# EAGLE board DM01x2 (EAGLE 6.6.0), part 1 of 3
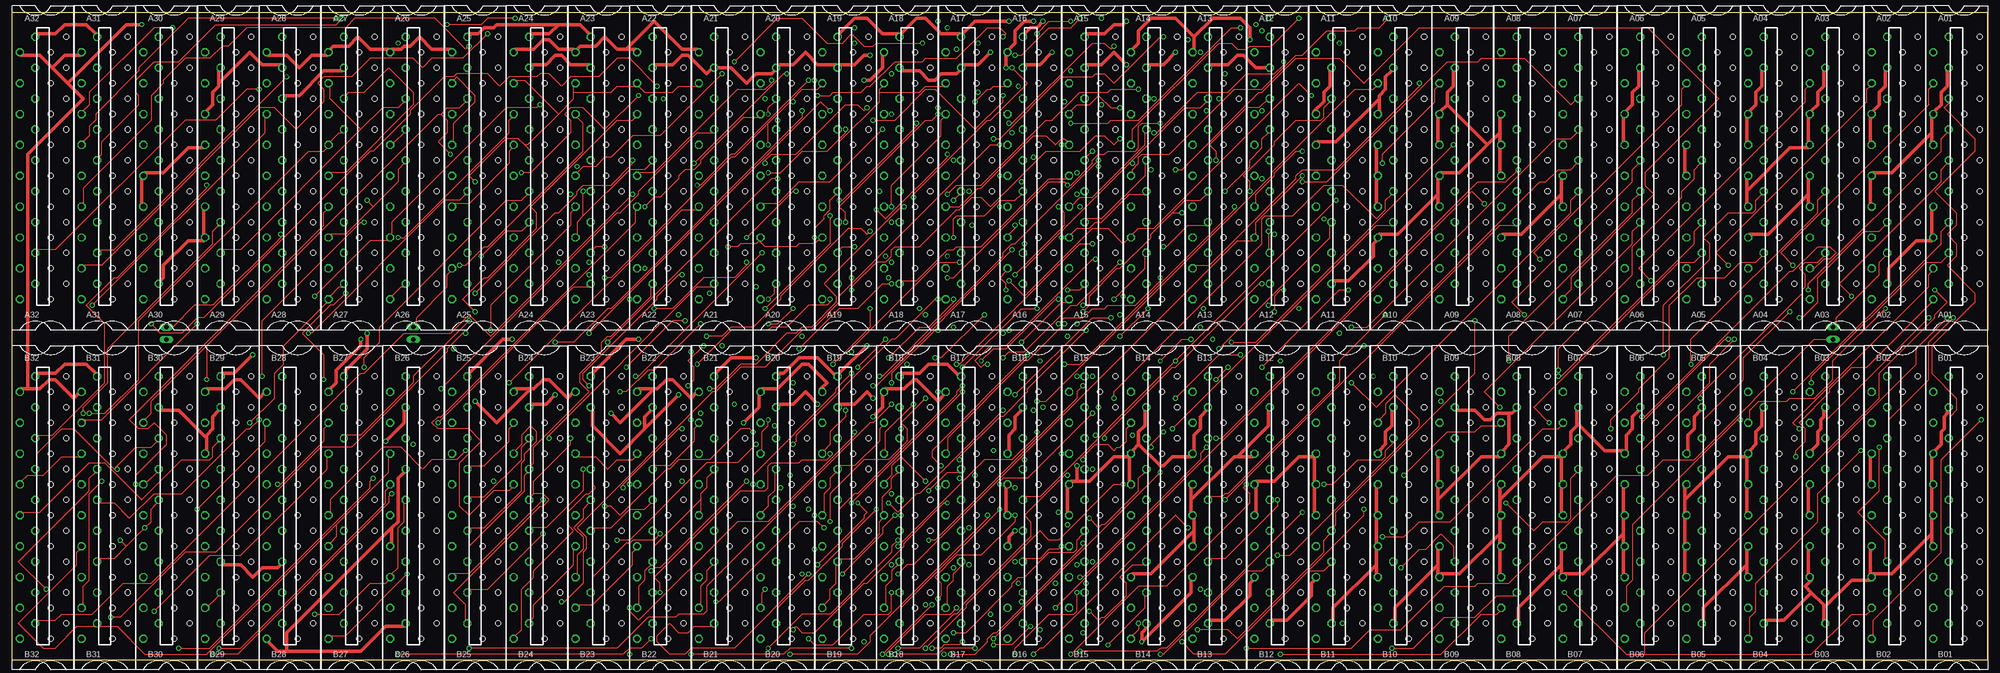
[diagram p6: board, top side]
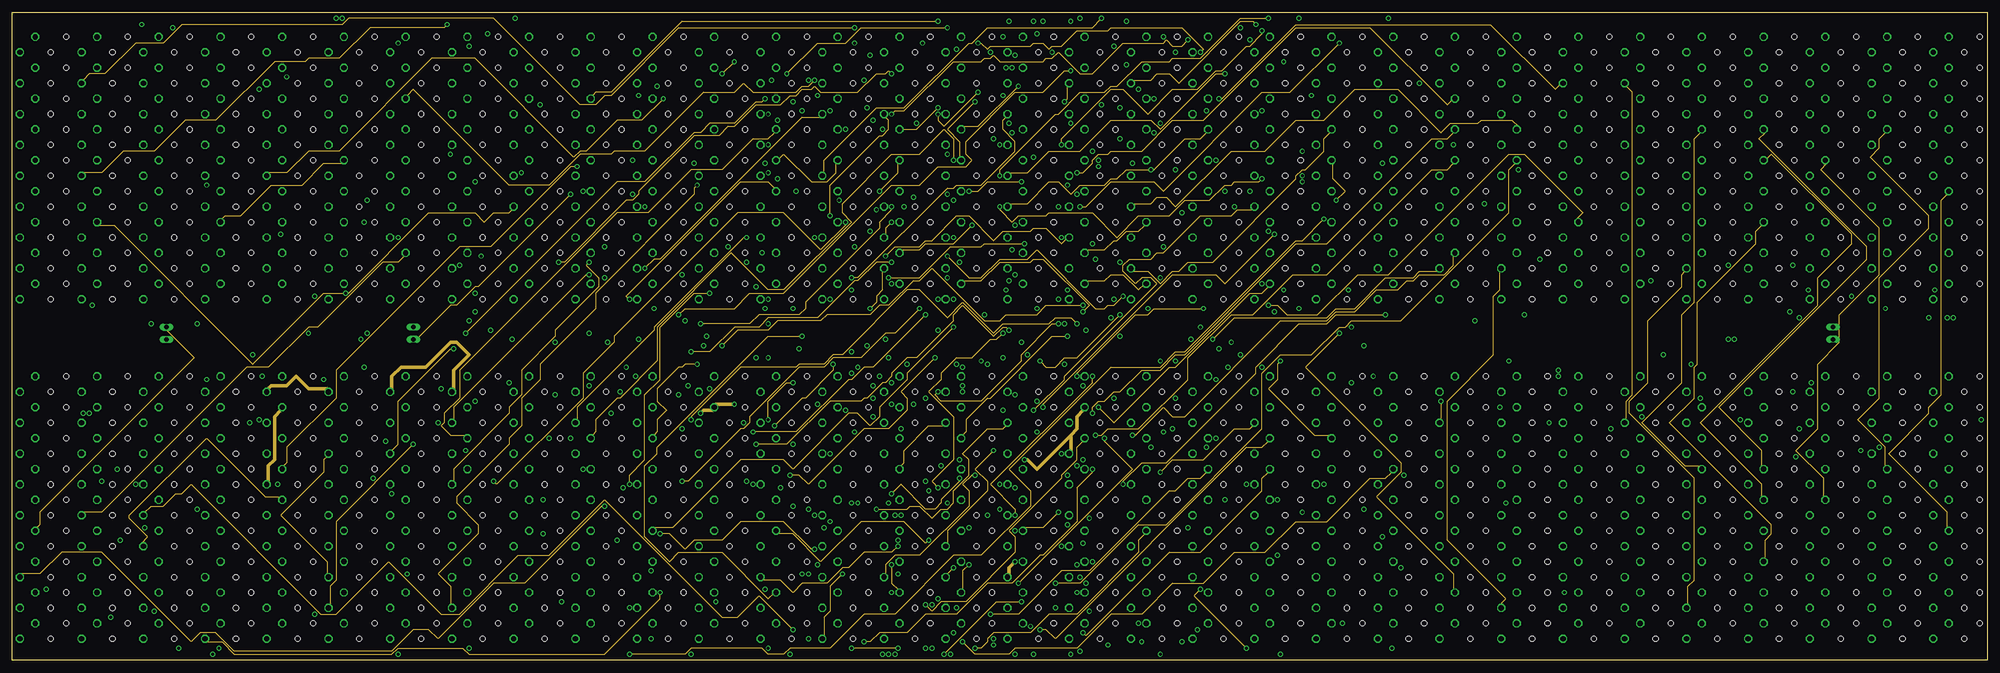
[diagram p7: board, inner layer Route2]
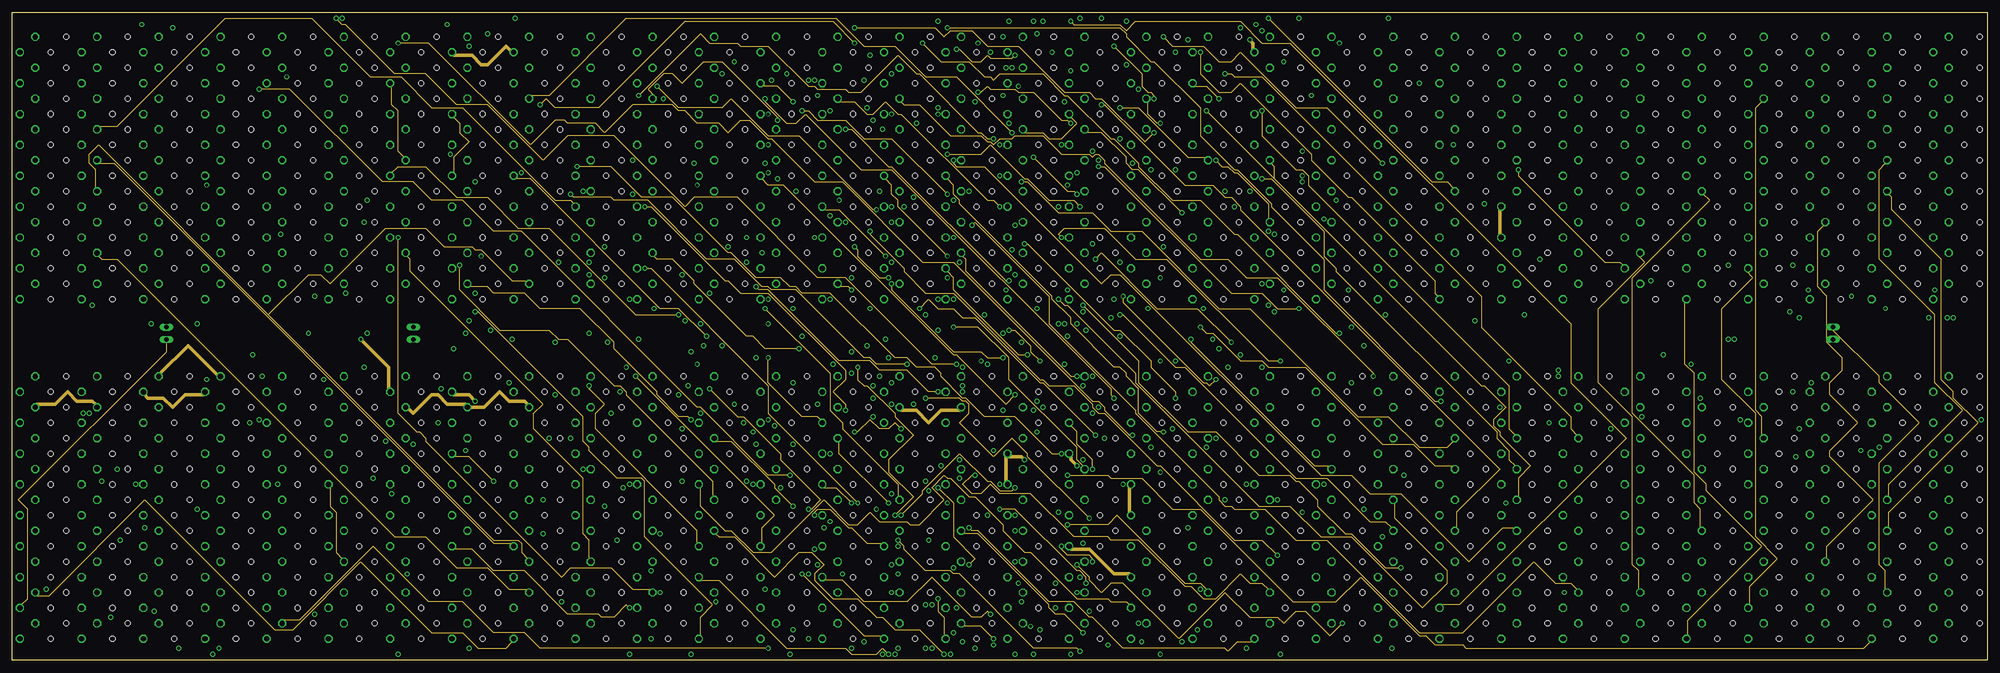
[diagram p8: board, inner layer Route15]
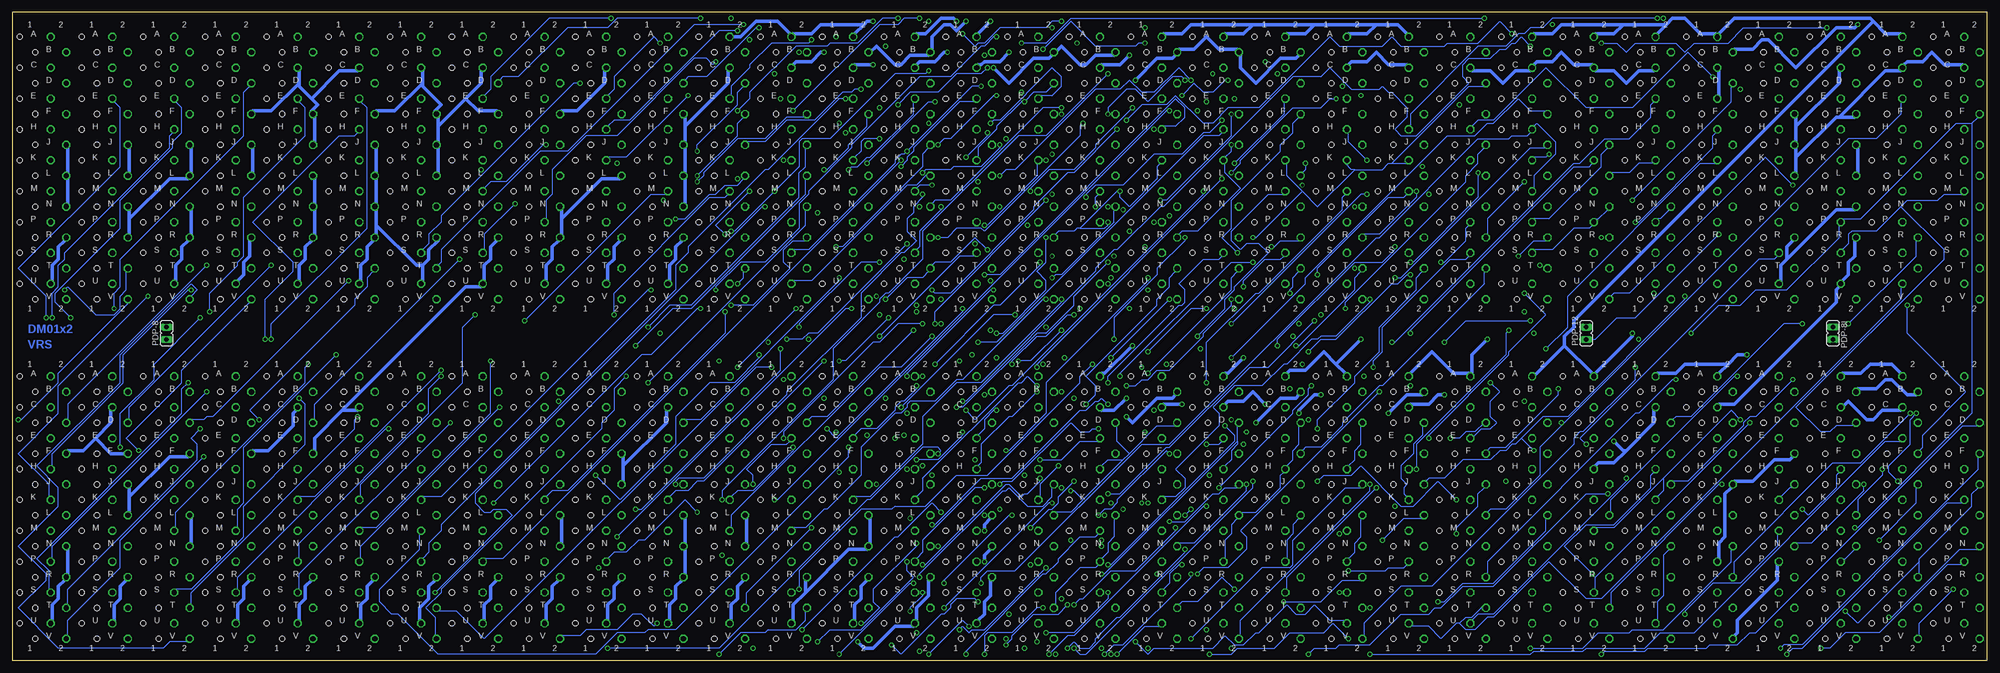
[diagram p9: board, bottom side, seen from below]

Size 406.4 x 133.35 mm. Coordinates in mm from the lower left corner, seen from the top.
Outline: 0,0 0,133.35 406.4,133.35 406.4,0 0,0
Copper layers (1*2*15*16): Top 0.035mm / dielectric 1.5mm / Route2 0.035mm / dielectric 0.15mm / Route15 0.035mm / dielectric 0.2mm / Bottom 0.035mm
Design rules "sierraproto": minimum track width 6mil, minimum drill 24mil, track to track 6mil, track to pad 6mil, pad to pad 10mil, via to via 6mil, smd to smd 6mil, copper to edge 25mil, drill to drill 10mil, minimum pad ring 10mil, minimum via ring 8mil, stop-mask expansion 0mil, vias tented up to drill 0mil, thermal gap 10mil
Net classes: 0 default: width 0.254 mm; 1 Supply: width 0.762 mm

## Footprints (pad centres in the part's own frame; a part is rotated, then mirrored left to right if it is on the bottom)
H807S = drill 1.092 octagon: A2 -1.587,28.575; B2 -4.763,25.4; C2 -1.587,22.225; D2 -4.763,19.05; E2 -1.587,15.875; F2 -4.763,12.7; H2 -1.587,9.525; J2 -4.763,6.35; K2 -1.587,3.175; L2 -4.763,0; M2 -1.587,-3.175; N2 -4.763,-6.35; P2 -1.587,-9.525; R2 -4.763,-12.7; S2 -1.587,-15.875; T2 -4.763,-19.05; U2 -1.587,-22.225; V2 -4.763,-25.4 | hole 1.092: 4.763,28.575; 1.587,25.4; 4.763,22.225; 1.587,19.05; 4.763,15.875; 1.587,12.7; 4.763,9.525; 1.587,6.35; 4.763,3.175; 1.587,0; 4.763,-3.175; 1.587,-6.35; 4.763,-9.525; 1.587,-12.7; 4.763,-15.875; 1.587,-19.05; 4.763,-22.225; 1.587,-25.4
JP1 = drill 0.914 long: 1 0,-1.27; 2 0,1.27

## Placement (x,y rotation side)
A01  W021S  [H807S]  400.05,99.69 0 top
A02  W021S  [H807S]  387.35,99.69 0 top
A03  W021S  [H807S]  374.65,99.69 0 top
A04  W021S  [H807S]  361.95,99.69 0 top
A05  W021S  [H807S]  349.25,99.69 0 top
A06  W021S  [H807S]  336.55,99.69 0 top
A07  W021S  [H807S]  323.85,99.69 0 top
A08  W021S  [H807S]  311.15,99.69 0 top
A09  W021S  [H807S]  298.45,99.69 0 top
A10  W021S  [H807S]  285.75,99.69 0 top
A11  W021S  [H807S]  273.05,99.69 0 top
A12  S107S  [H807S]  260.35,99.69 0 top
A13  S107S  [H807S]  247.65,99.69 0 top
A14  S107S  [H807S]  234.95,99.69 0 top
A15  W005S  [H807S]  222.25,99.69 0 top
A16  S111S  [H807S]  209.55,99.69 0 top
A17  S111S  [H807S]  196.85,99.69 0 top
A18  S111S  [H807S]  184.15,99.69 0 top
A19  S111S  [H807S]  171.45,99.69 0 top
A20  S111S  [H807S]  158.75,99.69 0 top
A21  S111S  [H807S]  146.05,99.69 0 top
A22  S111S  [H807S]  133.35,99.69 0 top
A23  S111S  [H807S]  120.65,99.69 0 top
A24  S111S  [H807S]  107.95,99.69 0 top
A25  S107S  [H807S]  95.25,99.69 0 top
A26  S111S  [H807S]  82.55,99.69 0 top
A27  S111S  [H807S]  69.85,99.69 0 top
A28  R202S  [H807S]  57.15,99.69 0 top
A29  W021S  [H807S]  44.45,99.69 0 top
A30  W021S  [H807S]  31.75,99.69 0 top
A31  S107S  [H807S]  19.05,99.69 0 top
A32  S181S  [H807S]  6.35,99.69 0 top
B01  W021S  [H807S]  400.05,29.84 0 top
B02  W021S  [H807S]  387.35,29.84 0 top
B03  W021S  [H807S]  374.65,29.84 0 top
B04  W021S  [H807S]  361.95,29.84 0 top
B05  W021S  [H807S]  349.25,29.84 0 top
B06  W021S  [H807S]  336.55,29.84 0 top
B07  W021S  [H807S]  323.85,29.84 0 top
B08  W021S  [H807S]  311.15,29.84 0 top
B09  W021S  [H807S]  298.45,29.84 0 top
B10  W021S  [H807S]  285.75,29.84 0 top
B11  W021S  [H807S]  273.05,29.84 0 top
B12  W021S  [H807S]  260.35,29.84 0 top
B13  W021S  [H807S]  247.65,29.84 0 top
B14  W021S  [H807S]  234.95,29.84 0 top
B15  W021S  [H807S]  222.25,29.84 0 top
B16  W021S  [H807S]  209.55,29.84 0 top
B17  R002S  [H807S]  196.85,29.84 0 top
B18  R002S  [H807S]  184.15,29.84 0 top
B19  R002S  [H807S]  171.45,29.84 0 top
B20  R002S  [H807S]  158.75,29.84 0 top
B21  R002S  [H807S]  146.05,29.84 0 top
B22  R002S  [H807S]  133.35,29.84 0 top
B23  S111S  [H807S]  120.65,29.84 0 top
B24  W005S  [H807S]  107.95,29.84 0 top
B25  S107S  [H807S]  95.25,29.84 0 top
B26  R603S  [H807S]  82.55,29.84 0 top
B27  S202S  [H807S]  69.85,29.84 0 top
B28  W640S  [H807S]  57.15,29.84 0 top
B29  R302S  [H807S]  44.45,29.84 0 top
B30  S111S  [H807S]  31.75,29.84 0 top
B31  S202S  [H807S]  19.05,29.84 0 top
B32  S107S  [H807S]  6.35,29.84 0 top
PDP-8  [JP1]  374.65,67.31 0 bottom
PDP-8I  [JP1]  31.75,67.31 180 bottom
PDP-12  [JP1]  82.55,67.31 0 bottom
U$9  [CBLOCK]  0,0 0 top
U$10  [CBLOCK]  50.8,0 0 top
U$11  [CBLOCK]  101.6,0 0 top
U$12  [CBLOCK]  152.4,0 0 top
U$13  [CBLOCK]  203.2,0 0 top
U$14  [CBLOCK]  254,0 0 top
U$15  [CBLOCK]  304.8,0 0 top
U$16  [CBLOCK]  355.6,0 0 top

## Tracks (layer width: path | path; a pad name or v marks a point on that pad's centre or on a via)
1-CA_INH  (via drill 0.61)
  Top 0.254: v20.32,8.89 22.23,8.89 35.56,22.23 41.91,22.23 63.5,43.81 69.85,43.81 89.53,63.5 89.53,64.14 92.71,67.31 v93.34,67.31 | v226.69,53.98 226.69,55.24 257.18,85.72 257.18,90.81 257.81,91.44 263.52,91.44 269.88,97.79 273.69,97.79 280.67,90.81 282.57,92.71 282.57,94.61 283.85,95.89 A10.M2
  Route2 0.254: v93.34,67.31 124.46,98.42 130.18,98.42 140.34,108.58 141.6,108.58 143.51,110.49 148.59,110.49 153.03,114.94 154.31,114.94 v154.94,115.57
  Route15 0.254: v154.94,115.57 154.94,114.94 159.38,110.49 161.29,110.49 163.19,112.39 174.62,100.97 180.97,100.97 226.06,55.88 226.06,54.61 v226.69,53.98
  Bottom 0.254: v20.32,8.89 19.68,8.89 5.71,22.86 1.91,22.86 B32.N2
1-CA_INH0  (via drill 0.61)
  Top 0.254: v124.46,24.77 127,24.77 142.88,40.64 149.22,40.64 v153.03,44.45
  Route2 0.254: v153.03,44.45 159.38,44.45 168.28,53.34 174.62,53.34 175.26,53.98 175.9,53.98 179.07,57.15 179.71,57.15 180.97,58.42 180.97,59.05 184.15,62.23 186.06,62.23 193.68,69.85 193.68,71.12 195.58,73.03 201.93,66.67 203.84,68.58 204.47,68.58 v205.1,67.94 | v211.46,61.59 212.72,60.33 214.63,60.33 216.53,62.23 219.07,62.23 v227.97,71.12
  Route15 0.254: v205.1,67.94 206.38,67.94 209.55,64.77 209.55,63.5 v211.46,61.59 | v227.97,71.12 228.6,71.12 239.4,60.33 241.3,60.33 264.16,37.47 270.51,37.47 279.4,28.57 282.57,28.57 283.85,27.3 B10.M2
  Bottom 0.254: v124.46,24.77 120.02,29.21 116.2,29.21 B23.L2
1-CA_INH1  (via drill 0.61)
  Top 0.254: v163.83,4.45 165.1,3.17 168.91,3.17 175.26,9.53 180.34,9.53 180.97,10.16 v180.97,13.97 | v193.68,5.71 196.22,5.71 205.74,15.24 205.74,15.88 207.01,17.14 208.28,17.14 213.36,22.23 218.44,22.23 219.07,22.86 219.07,24.77 220.34,26.04 B15.M2
  Bottom 0.254: v163.83,4.45 149.22,19.05 143.51,19.05 142.88,19.68 142.88,24.77 132.08,35.56 128.91,35.56 B22.J2 | v180.97,13.97 180.97,12.7 187.96,5.71 v193.68,5.71
!-BMB3
  Route2 0.254: B03.K2 372.75,33.66 372.75,37.47 367.03,43.18 371.48,47.62 371.48,60.96 375.92,65.41 375.92,71.12 384.18,79.38 384.18,88.9 372.11,100.97 373.38,102.23 A03.K2
!-BMB4
  Route15 0.254: B03.P2 373.38,20.95 373.38,23.5 382.9,33.02 374.01,41.91 374.01,43.18 379.73,48.9 374.01,54.61 374.01,57.15 376.56,59.69 376.56,62.23 373.38,65.41 373.38,74.93 371.48,76.83 371.48,88.27 372.75,89.53 A03.P2
!-BMB5  (via drill 0.61)
  Top 0.254: v335.28,50.16 335.92,50.16 365.76,80.01 366.39,80.01 371.48,85.09 374.01,85.09 375.29,83.82 374.01,82.55 372.75,82.55 370.2,80.01 A03.T2
  Bottom 0.254: v335.28,50.16 335.92,49.53 335.92,47.62 369.57,13.97 369.57,11.43 B03.T2
!-BMB6  (via drill 0.61)
  Top 0.254: v385.44,72.39 374.65,61.59 374.65,57.78 370.84,53.98 365.76,53.98 365.12,53.34 359.41,53.34 357.5,51.44 357.5,49.53 B04.D2
  Bottom 0.254: v385.44,72.39 385.44,75.56 384.18,76.83 384.18,82.55 358.77,107.95 358.77,116.84 357.5,118.11 A04.D2
!-BMB7
  Route2 0.254: B04.H2 360.05,40.01 360.05,43.18 351.15,52.07 381.63,82.55 381.63,85.09 359.41,107.31 360.68,108.58 A04.H2
!-BMB8  (via drill 0.61)
  Top 0.254: v339.73,62.87 339.73,73.03 349.25,82.55 349.25,85.72 347.98,87 353.06,92.08 358.14,92.08 358.77,92.71 358.77,94.61 360.05,95.89 A04.M2
  Bottom 0.254: v339.73,62.87 358.77,43.81 358.77,32.38 360.05,31.11 360.05,27.3 B04.M2
!BREAK  (via drill 0.61)
  Top 0.254: v48.9,48.9 53.98,53.98 53.98,59.05 55.88,60.96 55.88,64.77 64.77,73.66 A27.V2 65.41,74.93 67.31,76.83 67.94,76.83 A27.U2
  Bottom 0.254: v48.9,48.9 80.64,17.14 80.64,14.61 B26.S2
!BRK_SYNC_CLK
  Top 0.254: PDP-12.2 83.19,69.22 83.19,70.48 89.53,76.83 89.53,79.38 90.17,80.01 A25.T2
-15V  (via drill 0.61)
  Top 0.762: 243.21,128.27 243.21,125.73 A13.B2 | 243.21,128.27 239.4,132.08 234.31,132.08 231.78,129.54 231.78,127 230.5,125.73 A14.B2 | v254.63,127.64 254.63,130.18 252.73,132.08 247.01,132.08 243.21,128.27 | A28.B2 52.7,124.46 56.52,124.46 59.05,121.92 61.59,124.46 64.77,124.46 A27.B2 65.41,125.73 66.04,126.36 69.22,126.36 71.12,128.27 73.66,125.73 77.47,125.73 A26.B2 78.11,125.73 80.01,125.73 80.64,126.36 81.92,126.36 83.82,128.27 86.36,125.73 90.17,125.73 A25.B2 | v204.47,121.92 204.47,124.46 A16.B2 205.1,125.73 206.38,127 206.38,129.54 208.28,131.44 v210.19,131.44 | A24.B2 103.5,125.73 107.31,125.73 109.22,127.64 110.49,127.64 112.39,125.73 115.57,125.73 A23.B2 116.2,125.73 116.84,126.36 120.02,126.36 121.92,128.27 124.46,125.73 126.36,125.73 | 126.36,125.73 128.27,125.73 A22.B2 | 126.36,125.73 132.08,131.44 137.79,125.73 140.97,125.73 A21.B2 | v175.26,119.38 176.53,119.38 179.07,121.92 179.07,124.46 A18.B2 | B17.B2 191.77,54.61 190.5,53.34 186.06,57.78 185.42,57.78 183.51,55.88 179.71,55.88 B18.B2 179.07,54.61 179.07,52.07 v177.16,50.16 | B19.B2 166.37,55.88 167.64,57.15 163.83,60.96 162.56,60.96 157.48,55.88 154.31,55.88 B20.B2 153.67,54.61 153.67,52.07 v150.5,48.9 | 106.68,55.88 107.31,55.88 109.22,57.78 110.49,57.78 114.3,53.98 115.57,55.24 B23.B2 | 106.68,55.88 103.5,55.88 B24.B2 | 132.08,55.88 132.72,55.88 134.62,57.78 135.89,57.78 139.7,53.98 140.97,55.24 B21.B2 | 132.08,55.88 128.91,55.88 B22.B2 | v123.19,50.8 125.09,48.9 132.08,55.88 | v95.25,53.34 99.69,48.9 106.68,55.88 | B29.B2 40.01,55.88 43.81,55.88 45.72,57.78 46.99,57.78 50.8,53.98 52.07,55.24 B28.B2
  Top 0.762: 8.26,121.92 5.71,124.46 1.91,124.46 A32.B2 | 8.26,121.92 10.79,124.46 13.97,124.46 A31.B2 | 3.17,55.88 5.71,55.88 7.62,57.78 8.89,57.78 12.7,53.98 13.97,55.24 B31.B2 | 3.17,55.88 1.91,55.88 B32.B2 | 11.43,118.75 14.61,115.57 3.17,104.14 3.17,55.88 | 11.43,118.75 8.26,121.92 | v71.75,66.04 71.75,64.77 66.67,59.69 66.67,57.15 65.41,55.88 B27.B2 | v26.67,130.81 23.5,130.81 11.43,118.75
  Route2 0.762: B26.B2 78.11,55.88 78.11,58.42 80.01,60.33 85.09,60.33 90.17,65.41 91.44,65.41 93.98,62.87 90.81,59.69 90.81,55.88 B25.B2 | B27.B2 64.77,55.88 60.96,55.88 58.42,58.42 56.52,56.52 53.34,56.52 52.7,55.88 B28.B2
  Route15 0.762: v254.63,127.64 255.27,127 255.27,125.73 A12.B2 | A25.B2 90.81,124.46 94.61,124.46 96.52,122.56 97.79,122.56 101.6,126.36 102.87,125.09 A24.B2 | v95.25,53.34 93.98,54.61 90.81,54.61 B25.B2 | B29.B2 39.37,54.61 35.56,54.61 33.02,52.07 31.11,53.98 27.94,53.98 27.3,54.61 B30.B2 | v71.75,66.04 77.47,60.33 77.47,55.88 B26.B2
  Bottom 0.762: A14.B2 229.87,125.09 228.6,126.36 224.79,122.56 223.52,122.56 221.62,124.46 217.81,124.46 A15.B2 217.17,125.73 217.17,128.27 214.63,130.81 213.36,130.81 212.09,129.54 v210.19,131.44 | A18.B2 179.71,124.46 183.51,124.46 185.42,122.56 186.69,122.56 190.5,126.36 191.77,125.09 A17.B2 192.41,124.46 193.04,123.83 196.22,123.83 201.29,118.75 v204.47,121.92 | A21.B2 141.6,124.46 142.24,123.83 145.41,123.83 150.5,118.75 153.67,121.92 153.67,124.46 A20.B2 154.31,125.73 158.12,125.73 160.66,128.27 163.19,125.73 166.37,125.73 A19.B2 167,124.46 167.64,123.83 170.81,123.83 v175.26,119.38 | v177.16,50.16 175.9,48.9 170.81,53.98 167.64,53.98 167,54.61 B19.B2 | v123.19,50.8 119.38,54.61 116.2,54.61 B23.B2 | v150.5,48.9 145.41,53.98 142.24,53.98 141.6,54.61 B21.B2 | B30.B2 26.67,55.88 22.86,55.88 20.95,57.78 19.68,57.78 16.51,54.61 14.61,54.61 B31.B2 | v26.67,130.81 27.3,130.18 31.11,130.18 39.37,121.92 45.09,127.64 46.35,127.64 48.26,125.73 52.07,125.73 A28.B2
-AC_CLEAR  (via drill 0.61)
  Top 0.254: v306.07,52.07 302.89,55.24 333.38,85.72 333.38,88.27 334.64,89.53 A06.P2
  Bottom 0.254: v306.07,52.07 334.64,23.5 334.64,20.95 B06.P2
-BAC0  (via drill 0.61)
  Top 0.254: v366.39,81.28 363.86,83.82 394.33,114.3 394.33,117.47 394.97,118.11 A01.D2
  Bottom 0.254: v366.39,81.28 394.97,52.7 394.97,49.53 B01.D2
-BAC1
  Top 0.254: B01.E2 398.78,46.35 398.78,50.16 400.05,51.44 400.05,53.98 394.97,59.05 394.97,64.77 403.86,73.66 403.86,75.56 398.14,81.28 400.05,83.19 400.05,85.72 398.14,87.63 400.05,89.53 400.05,92.08 395.61,96.52 403.86,104.78 403.86,107.31 397.51,113.67 398.78,114.94 A01.E2
-BAC2  (via drill 0.61)
  Top 0.254: v369.57,76.2 369.57,77.47 396.88,104.78 396.88,107.31 398.14,108.58 A01.H2
  Bottom 0.254: v369.57,76.2 370.2,76.2 383.54,62.87 383.54,57.15 398.14,42.55 398.14,40.01 B01.H2
-BAC3  (via drill 0.61)
  Top 0.254: v378.46,74.93 375.92,77.47 396.88,98.42 396.88,100.97 398.14,102.23 A01.K2
  Bottom 0.254: v378.46,74.93 396.88,56.52 396.88,50.8 405.13,42.55 398.78,36.2 398.78,33.66 B01.K2
-BAC4
  Route2 0.254: B01.M2 398.14,27.3 398.14,30.48 386.08,42.55 394.33,50.8 394.33,52.07 396.88,54.61 396.88,94.61 398.14,95.89 A01.M2
-BAC5  (via drill 0.61)
  Top 0.254: v366.39,55.24 396.88,85.72 396.88,88.27 398.14,89.53 A01.P2
  Bottom 0.254: v366.39,55.24 398.14,23.5 398.14,20.95 B01.P2
-BAC6  (via drill 0.61)
  Top 0.254: v370.2,57.15 370.2,58.42 393.7,81.92 396.88,81.92 398.14,83.19 A01.S2
  Bottom 0.254: v370.2,57.15 371.48,55.88 371.48,50.8 401.32,20.95 398.78,18.41 398.78,14.61 B01.S2
-BAC7  (via drill 0.61)
  Top 0.254: v367.67,47.62 366.39,48.9 394.33,76.83 394.33,79.38 394.97,80.01 A01.T2
  Bottom 0.254: v367.67,47.62 369.57,45.72 368.3,44.45 368.3,41.27 394.97,14.61 394.97,11.43 B01.T2
-BAC8  (via drill 0.61)
  Top 0.254: v367.03,41.91 367.03,43.18 368.94,45.09 368.94,47.62 367.67,48.9 374.01,55.24 374.01,55.88 378.46,60.33 381.63,60.33 394.97,73.66 A01.V2
  Bottom 0.254: v367.03,41.91 384.18,24.77 384.18,19.05 394.97,8.26 394.97,5.08 B01.V2
-BAC9  (via drill 0.61)
  Top 0.254: v353.06,81.28 350.52,83.82 381.63,114.94 381.63,117.47 382.27,118.11 A02.D2
  Bottom 0.254: v353.06,81.28 382.27,52.07 382.27,49.53 B02.D2
-BAC10  (via drill 0.61)
  Top 0.254: v399.42,70.48 394.33,65.41 394.33,57.78 386.08,49.53 386.08,46.35 B02.E2
  Bottom 0.254: v399.42,70.48 399.42,74.93 405.13,80.64 384.18,101.6 384.18,113.67 385.44,114.94 A02.E2
-BAC11
  Route2 0.254: B02.H2 385.44,40.01 385.44,43.81 379.73,49.53 384.18,53.98 384.18,78.74 394.33,88.9 394.33,91.44 382.27,103.5 384.18,105.41 384.18,107.31 385.44,108.58 A02.H2
-BMB0  (via drill 0.61)
  Top 0.254: v337.19,78.11 334.64,80.64 368.94,114.94 368.94,117.47 369.57,118.11 A03.D2
  Bottom 0.254: v337.19,78.11 365.12,50.16 366.39,50.16 367.03,49.53 369.57,49.53 B03.D2
-BMB1  (via drill 0.61)
  Top 0.254: v394.33,70.48 373.38,49.53 373.38,46.35 B03.E2
  Bottom 0.254: v394.33,70.48 397.51,73.66 397.51,75.56 384.18,88.9 384.18,94.61 373.38,105.41 373.38,106.68 371.48,108.58 371.48,113.67 372.75,114.94 A03.E2
-BMB2  (via drill 0.61)
  Top 0.254: v398.14,70.48 391.8,64.14 391.8,60.96 373.38,42.55 373.38,40.01 B03.H2
  Bottom 0.254: v398.14,70.48 398.14,75.56 396.88,76.83 396.88,81.28 395.61,82.55 395.61,83.82 374.01,105.41 374.01,107.95 373.38,108.58 A03.H2
-BMB3  (via drill 0.61)
  Top 0.254: v345.44,60.96 345.44,66.04 371.48,92.08 371.48,94.61 372.75,95.89 A03.M2
  Bottom 0.254: v345.44,60.96 346.07,60.33 346.07,57.15 372.75,30.48 372.75,27.3 B03.M2
-BMB4  (via drill 0.61)
  Top 0.254: v347.35,53.98 347.35,54.61 368.3,75.56 368.3,76.2 368.94,76.83 368.94,79.38 367.67,80.64 368.94,81.92 371.48,81.92 372.75,83.19 A03.S2
  Bottom 0.254: v347.35,53.98 346.07,52.7 346.07,44.45 358.77,31.75 358.77,25.4 369.57,14.61 372.75,14.61 B03.S2
-BMB5
  Bottom 0.254: B03.V2 370.2,3.81 374.01,3.81 375.29,2.54 396.88,2.54 405.13,10.79 399.42,16.51 399.42,17.78 405.13,23.5 396.88,31.75 396.88,35.56 401.32,40.01 384.18,57.15 384.18,62.87 369.57,77.47 368.3,76.2 369.57,74.93 A03.V2
-BMB6
  Route15 0.254: B04.E2 360.05,46.35 360.05,50.16 358.77,51.44 358.77,113.67 360.05,114.94 A04.E2
-BMB7
  Route2 0.254: B04.K2 360.05,33.66 360.05,36.2 347.35,48.9 371.48,73.03 371.48,78.74 378.46,85.72 378.46,87.63 361.95,104.14 360.68,102.87 A04.K2
-BMB8
  Route2 0.254: B04.P2 360.68,20.95 360.68,24.77 361.95,26.04 361.95,27.94 341,48.9 346.07,53.98 346.07,60.33 346.71,60.96 346.71,73.66 358.77,85.72 358.77,88.27 360.05,89.53 A04.P2
-BMB9  (via drill 0.61)
  Top 0.254: v328.93,47.62 328.93,49.53 334.64,55.24 334.64,55.88 341,62.23 341,73.03 346.71,78.74 352.43,78.74 355.6,81.92 358.77,81.92 360.05,83.19 A04.S2
  Bottom 0.254: v328.93,47.62 329.56,47.62 360.05,17.14 360.05,14.61 B04.S2
-BMB10
  Route15 0.254: B04.T2 357.5,11.43 357.5,15.24 363.22,20.95 358.77,25.4 358.77,50.8 351.79,57.78 351.79,72.39 358.14,78.74 356.87,80.01 A04.T2
-BMB11  (via drill 0.61)
  Top 0.254: v380.37,43.18 371.48,34.29 371.48,28.57 358.77,15.88 358.77,10.16 357.5,8.89 357.5,5.08 B04.V2
  Bottom 0.254: v380.37,43.18 382.9,45.72 371.48,57.15 371.48,59.69 357.5,73.66 A04.V2
-BRK_IN_PRG  (via drill 0.61)
  Top 0.254: v51.44,58.42 51.44,69.85 71.75,90.17 v72.39,90.17
  Bottom 0.254: v51.44,58.42 52.07,58.42 77.47,33.02 77.47,30.48 B26.L2 | v72.39,90.17 71.75,90.17 56.52,105.41 56.52,107.95 55.88,108.58 A28.H2
-IM0  (via drill 0.61)
  Top 0.254: v314.32,82.55 313.06,83.82 343.54,114.3 343.54,117.47 344.17,118.11 A05.D2
  Bottom 0.254: v314.32,82.55 344.17,52.7 344.17,49.53 B05.D2
-IM1  (via drill 0.61)
  Top 0.254: v365.76,71.75 356.24,62.23 356.24,57.78 347.98,49.53 347.98,46.35 B05.E2
  Bottom 0.254: v365.76,71.75 365.76,75.56 360.05,81.28 360.05,81.92 358.77,83.19 358.77,95.25 346.07,107.95 346.07,113.67 347.35,114.94 A05.E2
-IM2
  Route2 0.254: B05.H2 347.35,40.01 344.17,40.01 335.28,48.9 343.54,57.15 343.54,71.12 346.07,73.66 346.07,107.31 347.35,108.58 A05.H2
-IM3  (via drill 0.61)
  Top 0.254: v318.13,59.69 318.13,64.14 333.38,79.38 333.38,85.09 343.54,95.25 343.54,96.52 346.07,99.06 346.07,100.97 347.35,102.23 A05.K2
  Bottom 0.254: v318.13,59.69 344.17,33.66 347.35,33.66 B05.K2
-IM4
  Route15 0.254: B05.M2 347.35,27.3 347.35,31.11 346.07,32.38 346.07,38.1 333.38,50.8 333.38,78.74 349.25,94.61 347.98,95.89 A05.M2
-IM5  (via drill 0.61)
  Top 0.254: v318.13,58.42 318.77,58.42 346.07,85.72 346.07,88.27 347.35,89.53 A05.P2
  Bottom 0.254: v318.13,58.42 320.68,55.88 320.68,50.8 347.35,24.13 347.35,20.95 B05.P2
-IM6  (via drill 0.61)
  Top 0.254: v316.23,48.9 313.06,52.07 342.9,81.92 346.07,81.92 347.35,83.19 A05.S2
  Bottom 0.254: v316.23,48.9 347.35,17.78 347.35,14.61 B05.S2
-IM7
  Route2 0.254: B05.T2 344.81,11.43 344.81,15.24 346.07,16.51 346.07,37.47 332.74,50.8 332.74,53.34 336.55,57.15 336.55,69.85 343.54,76.83 343.54,79.38 344.17,80.01 A05.T2
-IM8
  Route15 0.254: B05.V2 344.81,5.08 344.81,8.26 360.05,23.5 348.62,34.92 348.62,36.2 346.07,38.73 346.07,59.05 344.17,60.96 344.17,73.66 A05.V2
-IM9
  Route2 0.254: B06.D2 332.11,49.53 332.11,53.34 333.38,54.61 333.38,116.84 332.11,118.11 A06.D2
-IM10  (via drill 0.61)
  Top 0.254: v353.06,66.04 352.43,66.04 335.28,48.9 335.28,46.35 B06.E2
  Bottom 0.254: v353.06,66.04 353.06,69.22 333.38,88.9 333.38,113.67 334.64,114.94 A06.E2
-IM11  (via drill 0.61)
  Top 0.254: v354.33,66.04 349.25,60.96 349.25,57.15 335.28,43.18 335.28,40.01 B06.H2
  Bottom 0.254: v354.33,66.04 354.33,74.3 348.62,80.01 348.62,81.92 356.87,90.17 339.09,107.95 335.92,107.95 335.28,108.58 A06.H2
-INTERRUPT  (via drill 0.61)
  Top 0.254: v307.98,61.59 307.98,66.67 333.38,92.08 333.38,94.61 334.64,95.89 A06.M2
  Bottom 0.254: v307.98,61.59 307.98,50.8 331.47,27.3 334.64,27.3 B06.M2
-SKIP  (via drill 0.61)
  Top 0.254: v311.15,71.12 308.61,73.66 333.38,98.42 333.38,100.97 334.64,102.23 A06.K2
  Bottom 0.254: v311.15,71.12 313.69,68.58 313.69,57.15 334.64,36.2 334.64,33.66 B06.K2
ADD_ACC  (via drill 0.61)
  Top 0.254: 21.59,40.01 v21.59,39.37 | 21.59,40.01 25.4,43.81 28.57,43.81 29.84,45.09 B30.E2 | 21.59,40.01 20.95,39.37 12.7,47.62 10.16,47.62 5.08,42.55 5.08,40.01 B32.H2 | v302.89,93.98 300.36,96.52 v214.63,10.79 | v192.41,32.38 191.77,32.38 183.51,24.13 183.51,23.5 175.9,15.88 175.26,15.88 165.1,5.71 162.56,5.71 161.29,6.99 v160.66,6.35
  Route2 0.254: v160.66,6.35 153.67,13.34 149.22,8.89 146.05,8.89 121.92,33.02 110.49,21.59 104.14,21.59 92.08,9.53 88.27,9.53 77.47,20.32 66.67,9.53 63.5,9.53 36.83,36.2 34.92,34.29 33.66,34.29 31.11,31.75 28.57,31.75 27.3,30.48 B30.L2
  Bottom 0.254: v21.59,39.37 21.59,38.1 26.67,33.02 26.67,30.48 B30.L2 | v302.89,93.98 309.25,87.63 309.25,84.45 A08.S2 | v214.63,10.79 193.04,32.38 v192.41,32.38
ADD_ACC0  (via drill 0.61)
  Top 0.254: v283.85,2.54 288.29,2.54 294.64,8.89 300.99,8.89 305.44,13.34 309.25,13.34 B08.S2
  Route2 0.254: v116.2,101.6 114.94,101.6 98.42,85.09 92.08,85.09 66.67,59.69 66.67,53.98 56.52,43.81 56.52,40.64 55.88,40.01 B28.H2
  Route15 0.254: v215.9,42.55 214,42.55 206.38,50.16 200.03,50.16 196.22,53.98 195.58,53.98 191.13,58.42 191.13,59.05 189.87,60.33 186.06,60.33 184.15,62.23 181.61,62.23 168.28,75.56 162.56,75.56 161.29,76.83 160.02,76.83 158.12,78.74 153.03,78.74 147.96,83.82 147.32,83.82 135.89,95.25 129.54,95.25 123.19,101.6 v116.2,101.6
  Bottom 0.254: v283.85,2.54 260.99,2.54 230.5,33.02 229.87,33.02 219.07,43.81 215.9,43.81 215.26,43.18 v215.9,42.55
ADD_ACC1  (via drill 0.61)
  Top 0.254: v93.98,2.54 124.46,2.54 130.81,8.89 136.53,8.89 137.16,9.53 142.24,9.53 142.88,10.16 142.88,15.24 176.53,48.9 177.16,48.9 v180.97,52.7
  Route15 0.254: v217.17,27.94 225.43,27.94 227.33,29.84 241.3,15.88 244.47,15.88 245.75,14.61 B13.S2
  Bottom 0.254: v93.98,2.54 83.19,2.54 80.01,5.71 73.66,5.71 73.03,6.35 66.67,6.35 52.7,20.32 52.7,22.86 B28.N2 | v180.97,52.7 182.25,53.98 182.88,53.34 183.51,53.34 185.42,51.44 186.69,51.44 200.66,37.47 207.01,37.47 216.53,27.94 v217.17,27.94
B32M  (via drill 0.61)
  Top 0.254: v55.24,87.63 55.24,87 41.27,73.03 37.47,73.03 33.02,68.58 PDP-8I.1 | v254,2.54 275.59,2.54 279.4,6.35 285.75,6.35 294.64,15.24 300.99,15.24 301.62,15.88 307.98,15.88 330.2,38.1 336.55,38.1 339.73,41.27 346.07,41.27 370.84,66.04 PDP-8.1
  Route2 0.254: PDP-8I.1 31.75,67.94 37.47,62.23 5.71,30.48 5.71,27.94 5.08,27.3 B32.M2 | v254,2.54 243.21,13.34 v244.47,14.61 | v114.94,95.89 95.89,76.83 95.25,76.83 91.44,73.03 90.17,73.03 83.19,66.04 PDP-12.1
  Route15 0.254: v184.15,60.96 177.8,60.96 176.53,62.23 175.26,62.23 161.29,76.2 156.21,76.2 155.57,76.83 154.31,76.83 148.59,82.55 142.88,82.55 130.81,94.61 123.83,94.61 123.19,95.25 115.57,95.25 v114.94,95.89
  Bottom 0.254: v55.24,87.63 72.39,70.48 76.2,70.48 80.64,66.04 PDP-12.1 | v244.47,14.61 244.47,18.41 231.78,31.11 225.43,31.11 224.79,31.75 218.44,31.75 212.09,38.1 205.74,38.1 186.69,57.15 186.69,58.42 v184.15,60.96
B_ENABLE0  (via drill 0.61)
  Top 0.254: v247.65,102.87 247.65,104.78 246.38,106.05 254,113.67 256.54,113.67 258.44,115.57 A12.E2 | 71.75,109.22 76.2,113.67 79.38,113.67 80.64,114.94 A26.E2 | 71.75,109.22 46.99,84.45 43.18,84.45 A29.S2 | 71.75,109.22 65.41,115.57 65.41,118.11 A27.D2
  Route2 0.254: v82.55,44.45 66.67,28.57 66.67,16.51 65.41,15.24 65.41,11.43 B27.T2 | v241.94,127.64 240.66,126.36 238.76,126.36 237.49,127.64 236.85,127 228.6,127 222.25,120.65 219.71,120.65 215.26,125.09 214,123.83 212.72,123.83 212.09,123.19 203.2,123.19 201.93,124.46 201.29,123.83 200.03,123.83 199.39,123.19 193.68,123.19 183.51,113.03 181.61,113.03 v180.97,112.39 | v165.1,119.38 163.83,118.11 162.56,118.11 161.29,116.84 152.4,116.84 150.5,118.75 148.59,116.84 142.24,116.84 130.18,104.78 123.83,104.78 123.19,104.14 116.84,104.14 110.49,97.79 102.23,97.79 82.55,117.47 81.28,116.2 A26.E2
  Route15 0.254: v247.65,102.87 248.92,101.6 250.19,101.6 251.46,100.33 252.09,100.33 258.44,93.98 258.44,90.81 A12.P2
  Bottom 0.254: v82.55,44.45 83.82,45.72 46.99,82.55 43.81,82.55 43.18,83.19 A29.S2 | v241.94,127.64 242.57,127 250.19,127 254.63,122.56 254.63,121.92 258.44,118.11 258.44,116.2 A12.E2 | v180.97,112.39 180.97,113.67 177.16,117.47 175.26,117.47 172.72,114.94 167.64,120.02 165.74,120.02 v165.1,119.38
B_ENABLE1  (via drill 0.61)
  Top 0.254: v258.44,88.27 258.44,84.45 A12.S2 | v249.56,96.52 254.63,101.6 254.63,102.87 257.18,105.41 257.18,107.31 258.44,108.58 A12.H2 | v18.41,36.83 15.88,34.29 15.88,16.51 14.61,15.24 14.61,11.43 B31.T2 | v14.61,50.8 14.61,52.07 19.68,57.15 19.68,64.14 41.27,85.72 41.27,88.27 42.55,89.53 A29.P2
  Route2 0.254: A27.K2 67.94,102.23 64.14,102.23 59.69,97.79 53.34,97.79 46.99,91.44 43.81,91.44 43.18,90.81 A29.P2 | v217.81,121.28 216.53,121.28 212.09,116.84 206.38,116.84 196.22,106.68 196.22,104.14 197.49,102.87 196.22,101.6 190.5,101.6 186.69,97.79 180.97,97.79 158.75,75.56 151.76,75.56 148.59,72.39 138.43,72.39 v137.16,71.12
  Route15 0.254: v137.16,71.12 128.27,71.12 110.49,88.9 104.14,88.9 97.79,95.25 91.44,95.25 85.09,101.6 79.38,101.6 78.11,100.33 A26.L2
  Bottom 0.254: v258.44,88.27 257.81,88.27 v249.56,96.52 244.47,101.6 244.47,106.68 243.84,107.31 238.12,107.31 224.79,120.65 218.44,120.65 v217.81,121.28 | A27.K2 68.58,102.23 71.75,102.23 73.66,100.33 77.47,100.33 A26.L2 | v18.41,36.83 20.32,38.73 20.32,40.01 15.88,44.45 15.88,49.53 v14.61,50.8
BMPX0  (via drill 0.61)
  Top 0.254: v223.52,102.87 206.38,85.72 205.74,85.72 203.84,83.82 203.84,83.19 179.07,58.42 v178.44,58.42 | v151.13,81.92 151.13,81.28 148.59,78.74 142.24,78.74 135.89,72.39 v132.08,72.39 | A25.N2 90.81,93.98 93.98,93.98 102.23,102.23 102.23,104.78 102.87,105.41 A24.J2
  Bottom 0.254: v223.52,102.87 305.44,20.95 309.25,20.95 B08.P2 | v178.44,58.42 178.44,59.05 155.57,81.92 v151.13,81.92 | v132.08,72.39 132.08,73.66 107.31,98.42 107.31,99.69 104.78,102.23 104.78,104.14 103.5,105.41 A24.J2
BMPX1  (via drill 0.61)
  Top 0.254: v96.52,83.19 101.6,88.27 104.78,88.27 106.05,89.53 A24.P2 | v260.35,33.02 260.35,31.75 249.56,20.95 246.38,20.95 B13.P2
  Route2 0.254: v180.97,120.65 180.34,121.28 179.71,120.65 177.8,120.65 173.99,116.84 166.37,116.84 165.1,118.11 164.47,117.47 162.56,117.47 161.29,116.2 160.02,116.2 158.12,114.3 153.03,114.3 148.59,109.86 147.32,109.86 145.41,107.95 140.34,107.95 128.91,96.52 128.91,95.89 127.64,94.61 126.36,94.61 113.67,81.92 v112.39,81.92
  Bottom 0.254: v96.52,83.19 93.34,86.36 90.81,86.36 A25.R2 | v260.35,33.02 260.35,34.92 237.49,57.78 237.49,64.14 227.97,73.66 227.97,74.3 226.69,75.56 226.06,75.56 219.07,82.55 219.07,88.27 199.39,107.95 193.68,107.95 v180.97,120.65 | v112.39,81.92 111.76,81.92 107.31,86.36 107.31,88.9 106.68,89.53 A24.P2
BREAK  (via drill 0.61)
  Top 0.254: 74.3,93.34 79.38,98.42 79.38,100.97 80.64,102.23 A26.K2 | 74.3,93.34 68.58,87.63 65.41,87.63 A27.R2 | v249.56,33.02 306.07,89.53 309.25,89.53 A08.P2 | v168.28,113.03 166.37,114.94 v118.75,67.31 | 74.3,93.34 v73.03,94.61
  Route15 0.254: A26.D2 78.11,118.11 78.11,114.3 79.38,113.03 79.38,104.78 80.64,103.5 A26.K2
  Bottom 0.254: v249.56,33.02 248.92,33.02 168.91,113.03 v168.28,113.03 | v118.75,67.31 118.75,67.94 85.09,101.6 81.92,101.6 81.28,102.23 A26.K2 | v73.03,94.61 52.7,114.94 52.7,118.11 A28.D2
BRK_REQ  (via drill 0.61)
  Top 0.254: v79.38,1.27 125.73,1.27 127,2.54 129.54,2.54 v131.44,4.45 | v160.02,1.27 173.99,1.27 176.53,3.81 176.53,5.08 200.66,29.21 v200.66,29.84
  Route2 0.254: v214.63,15.88 219.71,15.88 231.78,27.94 237.49,27.94 257.18,47.62 257.18,59.05 260.99,62.87 267.33,62.87 273.05,68.58 274.32,68.58 275.59,69.85 285.75,69.85 307.98,92.08 307.98,100.97 309.25,102.23 A08.K2
  Bottom 0.254: v79.38,1.27 78.74,1.91 70.48,1.91 69.85,2.54 57.78,2.54 57.15,3.17 51.44,3.17 48.9,5.71 47.62,5.71 5.08,48.26 1.91,48.26 B32.D2 | v131.44,4.45 134.62,7.62 136.53,5.71 143.51,5.71 146.69,2.54 154.31,2.54 155.57,1.27 v160.02,1.27 | v200.66,29.84 201.29,29.84 214.63,16.51 v214.63,15.88
BRK_REQ0  (via drill 0.61)
  Top 0.254: v93.34,43.18 91.44,41.27 86.36,41.27 84.45,39.37 80.01,43.81 76.2,43.81 65.41,33.02 65.41,30.48 B27.L2 | v62.23,74.93 73.66,86.36 77.47,86.36 A26.R2 78.11,87.63 78.11,90.17 101.6,113.67 107.95,113.67 v108.58,114.3 | v206.38,124.46 207.65,124.46 213.36,130.18 217.81,130.18 v219.71,132.08
  Route15 0.254: 259.71,99.06 302.26,56.52 302.89,56.52 307.34,52.07 304.8,49.53 304.8,48.26 306.07,46.99 306.07,46.35 312.42,40.01 309.88,37.47 309.88,33.66 B08.K2 | 259.71,99.06 259.71,101.6 259.08,102.23 A12.K2 | v108.58,114.3 109.86,115.57 111.76,113.67 120.65,113.67 138.43,131.44 168.91,131.44 v173.35,127 | v194.31,125.73 194.94,125.73 197.49,123.19 199.39,123.19 200.66,124.46 201.29,123.83 205.74,123.83 v206.38,124.46 | v245.75,113.03 259.71,99.06
  Bottom 0.254: 95.89,45.72 v93.34,43.18 | 95.89,45.72 97.16,44.45 97.79,44.45 99.06,43.18 100.33,43.18 102.23,41.27 107.95,41.27 111.76,37.47 114.94,37.47 115.57,36.83 B23.J2 | v62.23,74.93 62.23,74.3 86.36,50.16 91.44,50.16 95.89,45.72 | v173.35,127 174.62,127 175.26,126.36 183.51,126.36 188.59,131.44 v194.31,125.73 | v219.71,132.08 222.88,132.08 224.16,130.81 227.97,130.81 v245.75,113.03
BRK_REQ1  (via drill 0.61)
  Top 0.254: v282.57,71.12 273.05,61.59 273.05,57.15 250.19,34.29 249.56,34.29 248.92,33.66 246.38,33.66 B13.K2 | v228.6,36.2 226.69,36.2 215.26,24.77 213.36,24.77 211.46,26.67 196.22,11.43 196.22,10.79 v187.96,2.54 | v151.13,36.83 133.35,19.05 132.08,19.05 v131.44,18.41
  Route2 0.254: B31.L2 14.61,30.48 18.41,30.48 48.26,60.33 52.7,60.33 60.96,68.58 62.87,68.58 76.2,81.92 79.38,81.92 80.64,83.19 A26.S2 | v282.57,71.12 272.42,71.12 270.51,69.22 264.8,69.22 255.91,60.33 255.91,59.05 237.49,40.64 232.41,40.64 228.6,36.83 v228.6,36.2
  Route15 0.254: B23.P2 118.75,20.95 118.75,24.77 117.47,26.04 117.47,37.47 107.31,47.62 107.31,50.8 109.22,52.7 81.92,80.01 81.92,82.55 81.28,83.19 A26.S2
  Bottom 0.254: v282.57,71.12 282.57,75.56 262.89,95.25 259.71,95.25 259.08,95.89 A12.M2 | v187.96,2.54 186.69,1.27 185.42,1.27 151.13,35.56 v151.13,36.83 | v131.44,18.41 123.83,18.41 123.19,19.05 120.02,19.05 119.38,19.68 B23.P2
BRK_SYNC_CLK  (via drill 0.61)
  Top 0.254: v247.65,45.72 248.92,45.72 301.62,98.42 307.34,98.42 v309.88,100.97 | v355.6,49.53 354.96,49.53 333.38,27.94 333.38,16.51 332.11,15.24 332.11,11.43 B06.T2
  Route2 0.254: v139.7,49.53 139.7,50.16 149.86,60.33 161.29,60.33 161.93,60.96 167,60.96 168.91,62.87 170.81,62.87 184.15,76.2 186.69,76.2 192.41,70.48 195.58,73.66 201.93,67.31 203.84,69.22 213.36,69.22 214.63,70.48 217.81,70.48 v219.07,69.22
  Route15 0.254: v139.7,49.53 139.06,50.16 137.16,50.16 132.72,54.61 132.72,55.24 123.83,64.14 123.83,65.41 116.84,72.39 108.58,72.39 105.41,75.56 99.06,75.56 97.79,76.83 93.98,76.83 A25.U2 | v309.88,100.97 309.88,99.69 327.66,81.92 330.83,81.92 331.47,81.28 A06.T2
  Bottom 0.254: v219.07,69.22 224.16,69.22 227.97,65.41 229.24,65.41 247.65,46.99 v247.65,45.72 | v355.6,49.53 357.5,51.44 335.92,73.03 335.92,74.3 333.38,76.83 333.38,78.74 332.11,80.01 A06.T2
BT1B
  Top 0.254: PDP-8.2 375.29,69.22 375.29,70.48 384.18,79.38 384.18,81.92 385.44,83.19 A02.S2
  Route15 0.254: B02.S2 385.44,14.61 385.44,18.41 384.18,19.68 384.18,40.64 392.43,48.9 384.18,57.15 384.18,58.42 374.65,67.94 PDP-8.2
CYC_SEL  (via drill 0.61)
  Top 0.254: v155.57,100.33 158.12,100.33 162.56,104.78 167.64,104.78 171.45,108.58 v171.45,109.22 | v205.1,78.11 208.28,74.93 222.25,88.9 225.43,88.9 228.6,85.72 229.87,87 A14.R2 230.5,87.63 231.78,88.9 234.95,88.9 264.8,118.75 v267.33,116.2
  Route2 0.254: v133.99,115.57 129.54,111.12 124.46,111.12 118.11,104.78 116.84,104.78 115.57,103.5 95.25,123.83 86.36,123.83 67.31,104.78 60.96,104.78 56.52,100.33 52.7,100.33 A28.L2
  Route15 0.254: v171.45,109.22 172.72,109.22 180.34,101.6 180.97,101.6 204.47,78.11 v205.1,78.11
  Bottom 0.254: v133.99,115.57 135.25,115.57 137.16,113.67 142.88,113.67 153.67,102.87 153.67,102.23 v155.57,100.33 | v267.33,116.2 280.04,103.5 283.85,103.5 A10.K2
CYC_SEL0  (via drill 0.61)
  Top 0.254: v215.26,74.3 214.63,74.3 204.47,64.14 201.93,64.14 v199.39,61.59 | v190.5,67.94 189.87,67.94 180.97,59.05 v180.97,57.15
  Route15 0.254: v215.26,74.3 216.53,73.03 217.17,73.03 231.14,59.05 231.14,57.15 256.54,31.75 262.89,31.75 269.24,25.4 275.59,25.4 290.19,10.79 295.27,15.88 295.27,18.41 284.48,29.21 284.48,32.38 B10.K2
  Bottom 0.254: v199.39,61.59 196.85,61.59 v190.5,67.94 | v180.97,57.15 180.97,58.42 166.37,73.03 165.74,73.03 165.1,73.66 165.1,76.2 166.37,77.47 161.29,82.55 158.12,82.55 157.48,83.19 A20.S2
CYC_SEL1  (via drill 0.61)
  Top 0.254: v195.58,56.52 194.31,55.24 194.31,54.61 173.99,34.29 173.35,34.29 170.18,31.11 170.18,27.3 B19.M2
  Bottom 0.254: v195.58,56.52 197.49,58.42 198.75,57.15 199.39,57.15 219.07,37.47 219.07,34.92 220.34,33.66 B15.K2
DA0  (via drill 0.61)
  Route2 0.254: v248.28,115.57 248.92,115.57 264.16,130.81 304.17,130.81 317.5,117.47 318.77,118.75 A07.D2
  Route15 0.254: v248.28,115.57 245.75,118.11 243.21,118.11 A13.D2
DA0-0  (via drill 0.61)
  Top 0.254: v227.97,66.67 v233.68,72.39 | v281.94,25.4 286.38,25.4 289.56,28.57 295.91,28.57 314.96,47.62 318.13,47.62 318.77,48.26 B07.D2
  Bottom 0.254: v227.97,66.67 211.46,83.19 208.28,83.19 A16.S2 | v233.68,72.39 234.95,72.39 v281.94,25.4
DA0-1  (via drill 0.61)
  Top 0.254: v236.22,38.73 v201.93,4.45
  Route2 0.254: v236.22,38.73 238.76,41.27 245.11,41.27 251.46,47.62 254.63,47.62 255.27,48.26 B12.D2
  Route15 0.254: v201.93,4.45 199.39,6.99 195.58,6.99 B17.U2
DA1  (via drill 0.61)
  Top 0.254: v265.43,98.42 270.51,98.42 295.27,123.19 301.62,123.19 302.26,123.83 311.15,123.83 320.68,114.3 321.94,115.57 A07.E2
  Bottom 0.254: v265.43,98.42 264.16,99.69 264.16,100.33 257.18,107.31 251.46,107.31 247.01,111.76 243.21,111.76 A13.F2
DA1-0  (via drill 0.61)
  Route2 0.254: v249.56,120.65 247.65,120.65 236.22,109.22 234.31,111.12 226.06,111.12 219.71,104.78 213.36,104.78 208.91,100.33 205.1,100.33 A16.L2
  Route15 0.254: v249.56,120.65 250.82,120.65 251.46,120.02 257.18,120.02 302.26,74.93 302.26,68.58 320.68,50.16 320.68,47.62 321.94,46.35 B07.E2
DA1-1  (via drill 0.61)
  Route2 0.254: v193.68,19.05 192.41,17.78 B17.R2 | v211.46,6.35 212.72,6.35 214.63,4.45 254,43.81 257.18,43.81 258.44,45.09 B12.E2
  Bottom 0.254: v193.68,19.05 206.38,6.35 208.91,6.35 209.55,5.71 210.82,6.99 v211.46,6.35
DA2  (via drill 0.61)
  Top 0.254: v275.59,68.58 278.76,68.58 317.5,107.31 320.68,107.31 321.94,108.58 A07.H2
  Bottom 0.254: v275.59,68.58 271.14,73.03 266.7,73.03 244.47,95.25 244.47,100.33 243.21,101.6 243.21,105.41 A13.J2
DA2-0  (via drill 0.61)
  Top 0.254: v307.34,32.38 313.06,26.67 314.96,28.57 320.04,28.57 320.68,29.21 320.68,37.47 321.94,38.73 B07.H2
  Route15 0.254: v223.52,101.6 224.79,101.6 250.82,75.56 257.18,75.56 260.35,72.39 v264.8,72.39
  Bottom 0.254: v223.52,101.6 222.25,102.87 222.25,103.5 220.98,104.78 220.98,105.41 211.46,114.94 208.28,114.94 A16.E2 | v264.8,72.39 265.43,72.39 274.95,62.87 276.86,62.87 v307.34,32.38
DA2-1  (via drill 0.61)
  Route2 0.254: v220.34,5.71 220.98,5.08 238.12,22.23 244.47,22.23 257.18,34.92 257.18,37.47 258.44,38.73 B12.H2
  Route15 0.254: v220.34,5.71 216.53,9.53 214.63,9.53 213.36,10.79 213.36,11.43 198.75,26.04 195.58,26.04 B17.M2
DA3  (via drill 0.61)
  Top 0.254: v278.13,64.77 280.67,64.77 314.32,98.42 315.6,98.42 318.13,100.97 320.68,100.97 321.94,102.23 A07.K2
  Bottom 0.254: v278.13,64.77 270.51,72.39 266.7,72.39 243.21,95.89 243.21,99.06 A13.L2
DA3-0  (via drill 0.61)
  Top 0.254: v274.95,76.2 273.05,76.2 v257.18,60.33
  Route2 0.254: v245.11,72.39 234.95,72.39 233.68,71.12 231.14,71.12 219.07,59.05 v219.07,58.42
  Route15 0.254: v219.07,58.42 217.81,58.42 196.22,80.01 196.22,82.55 195.58,83.19 A17.S2
  Bottom 0.254: v274.95,76.2 275.59,76.2 318.13,33.66 321.94,33.66 B07.K2 | v245.11,72.39 v257.18,60.33
DA3-1  (via drill 0.61)
  Top 0.254: v219.71,17.14 220.34,17.14 244.47,41.27 244.47,42.55 v245.75,43.81
  Bottom 0.254: v219.71,17.14 219.71,17.78 202.56,34.92 201.93,34.92 201.29,35.56 197.49,31.75 194.31,31.75 192.41,33.66 192.41,35.56 B17.J2 | v245.75,43.81 245.75,43.18 254,34.92 257.18,34.92 258.44,33.66 B12.K2
DA4  (via drill 0.61)
  Top 0.254: v275.59,57.15 280.67,52.07 320.68,92.08 320.68,94.61 321.94,95.89 A07.M2
  Bottom 0.254: v275.59,57.15 243.21,89.53 243.21,92.71 A13.N2
DA4-0  (via drill 0.61)
  Top 0.254: v234.31,43.81 234.31,44.45 v236.85,46.99
  Route15 0.254: v236.85,46.99 235.59,46.99 231.78,50.8 231.78,55.88 229.24,58.42 229.24,59.05 227.97,60.33 226.69,60.33 217.81,69.22 217.81,70.48 214,74.3 214,74.93 194.94,93.98 194.94,94.61 193.68,95.89 193.68,97.79 192.41,99.06 A17.L2
  Bottom 0.254: v234.31,43.81 234.31,41.91 269.88,6.35 275.59,6.35 276.23,5.71 281.94,5.71 286.38,1.27 318.77,1.27 327.02,9.53 328.3,9.53 330.83,12.06 330.83,14.61 322.58,22.86 322.58,26.04 B07.M2
DA4-1  (via drill 0.61)
  Route2 0.254: v217.17,66.67 214,66.67 201.29,53.98 200.66,53.98 196.22,49.53 196.22,46.99 195.58,46.35 B17.E2
  Bottom 0.254: v217.17,66.67 223.52,60.33 227.97,60.33 258.44,29.84 258.44,27.3 B12.M2
DA5  (via drill 0.61)
  Route2 0.254: v258.44,73.03 260.35,73.03 262.25,71.12 268.61,71.12 276.86,79.38 283.21,79.38 307.98,104.14 311.15,104.14 323.21,92.08 321.94,90.81 A07.P2
  Bottom 0.254: v258.44,73.03 254,73.03 246.38,80.64 247.65,81.92 247.65,84.45 245.75,86.36 243.21,86.36 A13.R2
DA5-0  (via drill 0.61)
  Top 0.254: v205.1,110.49 205.74,110.49 222.25,127 224.79,127 226.06,125.73 v226.69,126.36
  Route15 0.254: v226.69,126.36 232.41,120.65 232.41,118.11 233.68,116.84 234.31,116.84 234.95,116.2 v234.95,115.57
  Bottom 0.254: v205.1,110.49 204.47,111.12 203.2,111.12 192.41,121.92 190.5,120.02 190.5,118.11 192.41,116.2 194.94,116.2 A17.E2 | v234.95,115.57 236.22,115.57 250.82,100.97 251.46,100.97 267.33,85.09 267.33,83.82 269.88,81.28 269.88,76.2 318.13,27.94 318.13,26.67 320.68,24.13 320.68,22.23 321.94,20.95 B07.P2
DA5-1  (via drill 0.61)
  Top 0.254: v203.2,31.11 182.88,10.79 182.88,8.26 B18.U2 | v236.22,1.27 236.85,1.27 254,18.41 257.18,18.41 258.44,19.68 B12.P2
  Route15 0.254: v203.2,31.11 206.38,31.11 219.07,18.41 219.71,18.41 220.98,17.14 v220.98,15.88
  Bottom 0.254: v220.98,15.88 221.62,15.88 v236.22,1.27
DA6  (via drill 0.61)
  Top 0.254: v289.56,118.75 289.56,118.11 272.42,100.97 265.43,100.97 264.16,99.69 264.16,99.06 246.38,81.28 243.21,81.28 A13.T2
  Bottom 0.254: v289.56,118.75 290.83,118.75 318.13,91.44 318.13,90.17 320.68,87.63 320.68,85.72 321.94,84.45 A07.S2
DA6-0  (via drill 0.61)
  Route2 0.254: v197.49,89.53 193.68,85.72 187.96,85.72 186.69,84.45 182.88,84.45 A18.S2
  Route15 0.254: v197.49,89.53 198.12,90.17 213.36,74.93 213.36,69.22 231.14,51.44 231.14,50.8 248.28,33.66 248.28,33.02 249.56,31.75 250.82,31.75 251.46,31.11 257.81,31.11 264.16,24.77 270.51,24.77 289.56,5.71 298.45,5.71 313.06,20.32 317.5,15.88 320.68,15.88 321.94,14.61 B07.S2
DA6-1  (via drill 0.61)
  Route2 0.254: v198.12,38.1 197.49,38.1 195.58,36.2 196.85,34.92 196.85,31.75 186.69,21.59 181.61,21.59 179.71,19.68 179.71,17.78 B18.R2
  Route15 0.254: v198.12,38.1 197.49,38.1 195.58,36.2 197.49,34.29 199.39,34.29 201.29,36.2 203.2,34.29 209.55,34.29 218.44,25.4 225.43,25.4 226.06,24.77 231.78,24.77 241.3,15.24 242.57,15.24 245.11,12.7 247.65,12.7 252.73,17.78 254.63,15.88 257.18,15.88 258.44,14.61 B12.S2
DA7  (via drill 0.61)
  Route2 0.254: v255.91,130.81 255.27,131.44 252.73,131.44 240.03,118.75 238.12,120.65 235.59,120.65 234.31,119.38 230.5,119.38 A14.D2
  Bottom 0.254: v255.91,130.81 266.06,130.81 292.1,104.78 297.81,104.78 318.13,84.45 318.13,81.92 318.77,81.28 A07.T2
DA7-0  (via drill 0.61)
  Top 0.254: v247.65,57.78 v250.19,60.33
  Route2 0.254: v228.6,74.93 226.69,73.03 225.43,73.03 224.79,72.39 222.88,72.39 210.82,84.45 208.91,82.55 203.2,82.55 199.39,78.74 196.85,78.74 v192.41,83.19
  Route15 0.254: v247.65,57.78 246.38,56.52 245.75,57.15 245.11,57.15 228.6,73.66 v228.6,74.93 | v192.41,83.19 182.25,93.34 182.25,94.61 180.97,95.89 180.97,97.79 179.71,99.06 A18.L2
  Bottom 0.254: v250.19,60.33 253.37,60.33 309.25,4.45 314.96,10.16 318.77,10.16 B07.T2
DA7-1  (via drill 0.61)
  Top 0.254: v241.94,27.3 239.4,29.84 212.09,2.54 211.46,2.54 v210.19,1.27
  Bottom 0.254: v241.94,27.3 255.27,13.97 255.27,11.43 B12.T2 | v210.19,1.27 210.19,1.91 194.31,17.78 193.68,17.78 191.13,20.32 191.13,20.95 186.69,25.4 183.51,25.4 182.88,26.04 B18.M2
DA8  (via drill 0.61)
  Top 0.254: v239.4,100.97 240.66,100.97 256.54,116.84 257.18,116.84 264.16,123.83 273.05,123.83 278.13,118.75 289.56,130.18 336.55,130.18 351.15,115.57 335.92,100.33 335.92,97.79 337.82,95.89 320.68,78.74 320.68,76.2 319.4,74.93 A07.V2
  Bottom 0.254: v239.4,100.97 238.76,100.97 234.31,105.41 234.31,106.05 230.5,109.86 230.5,111.76 A14.F2
DA8-0  (via drill 0.61)
  Route15 0.254: v280.04,58.42 280.04,59.05 260.35,78.74 254,78.74 250.19,82.55 244.47,82.55 224.79,102.23 224.79,102.87 223.52,104.14 222.88,104.14 222.25,103.5 221.62,104.14 215.9,104.14 212.09,107.95 206.38,107.95 205.74,107.31 203.2,107.31 201.93,106.05 201.29,106.68 200.66,106.68 199.39,107.95 193.04,107.95 186.69,114.3 183.51,114.3 182.88,114.94 A18.E2
  Bottom 0.254: v280.04,58.42 282.57,55.88 282.57,51.44 285.12,48.9 285.12,47.62 318.13,14.61 318.13,13.97 321.31,10.79 319.4,8.89 319.4,5.08 B07.V2
DA8-1  (via drill 0.61)
  Top 0.254: v187.96,36.83 182.88,41.91 180.97,40.01 180.97,38.1 179.71,36.83 B18.J2
  Route15 0.254: v196.85,27.3 197.49,26.67 198.75,26.67 213.36,12.06 218.44,12.06 221.62,8.89 222.25,8.89 228.6,2.54 249.56,2.54 250.19,1.91 252.09,3.81 255.27,3.81 B12.V2
  Bottom 0.254: v196.85,27.3 193.04,31.11 192.41,31.11 191.13,32.38 191.13,33.66 v187.96,36.83
DA9  (via drill 0.61)
  Top 0.254: v264.8,132.08 259.08,126.36 254.63,126.36 254,125.73 252.09,125.73 250.82,127 248.28,127 230.5,109.22 230.5,106.68 A14.J2
  Bottom 0.254: v264.8,132.08 281.94,132.08 283.85,130.18 292.1,130.18 302.26,120.02 305.44,120.02 306.07,119.38 A08.D2
DA9-0  (via drill 0.61)
  Top 0.254: v286.38,38.1 295.27,46.99 300.99,46.99 302.26,48.26 306.07,48.26 B08.D2 | v252.73,62.87 248.28,62.87 v239.4,53.98 | v173.35,85.09 170.81,85.09 170.18,84.45 A19.S2
  Route2 0.254: v208.28,85.72 200.03,85.72 199.39,85.09 193.04,85.09 186.69,78.74 v180.34,78.74
  Route15 0.254: v239.4,53.98 239.4,55.24 234.31,60.33 234.31,61.59 227.97,67.94 226.69,67.94 208.91,85.72 v208.28,85.72 | v180.34,78.74 178.44,78.74 173.99,83.19 173.99,84.45 v173.35,85.09
  Bottom 0.254: v286.38,38.1 281.31,33.02 269.88,44.45 269.88,50.16 262.89,57.15 257.81,57.15 252.73,62.23 v252.73,62.87
DA9-1  (via drill 0.61)
  Top 0.254: v194.94,41.27 194.94,41.91 203.2,50.16 203.84,50.16 208.91,55.24 208.91,55.88 v220.98,67.94
  Bottom 0.254: v194.94,41.27 190.5,41.27 186.69,45.09 182.88,45.09 B18.E2 | v220.98,67.94 238.76,50.16 241.94,50.16 242.57,49.53 B13.D2
DA10  (via drill 0.61)
  Top 0.254: v283.21,132.08 281.31,130.18 276.86,130.18 276.23,129.54 270.51,129.54 265.43,124.46 264.16,124.46 257.18,117.47 251.46,117.47 238.12,104.14 232.41,104.14 231.78,103.5 231.78,102.23 230.5,100.97 230.5,100.33 A14.L2
  Bottom 0.254: v283.21,132.08 295.91,132.08 307.98,120.02 307.98,117.47 309.25,116.2 A08.E2
DA10-0  (via drill 0.61)
  Route2 0.254: v224.16,132.08 222.25,130.18 200.66,130.18 197.49,127 196.85,127 183.51,113.67 177.8,113.67 167,102.87 167,100.33 A19.L2
  Route15 0.254: v257.18,113.03 257.18,107.95 264.16,100.97 265.43,100.97 266.7,99.69 266.7,97.79 307.98,56.52 307.98,47.62 309.25,46.35 B08.E2
  Bottom 0.254: v224.16,132.08 227.33,132.08 232.41,127 238.12,127 238.76,126.36 245.11,126.36 254.63,116.84 254.63,115.57 v257.18,113.03
DA10-1  (via drill 0.61)
  Top 0.254: v189.23,11.43 v179.07,1.27 | v201.93,3.17 205.74,3.17 v209.55,6.99 | v217.81,1.27 231.78,15.24 237.49,15.24 254.63,32.38 254.63,34.29 253.37,35.56 v254,36.2
  Bottom 0.254: v179.07,1.27 173.35,6.99 170.18,6.99 B19.U2 | v189.23,11.43 191.13,9.53 196.22,9.53 200.66,5.08 200.66,4.45 v201.93,3.17 | v209.55,6.99 210.82,8.26 v217.81,1.27 | v254,36.2 254,38.1 255.27,39.37 250.19,44.45 247.01,44.45 246.38,45.09 B13.E2
DA11
  Route2 0.254: A14.N2 230.5,93.98 234.31,93.98 235.59,95.25 237.49,95.25 239.4,93.34 250.82,104.78 257.81,104.78 264.16,111.12 269.88,111.12 276.23,117.47 285.12,117.47 294,108.58 295.91,110.49 301.62,110.49 302.26,111.12 308.61,111.12 309.88,109.86 A08.H2
DA11-0  (via drill 0.61)
  Route2 0.254: v203.2,93.34 203.2,92.71 205.74,90.17 207.01,91.44 212.72,91.44 213.36,92.08 222.25,92.08 227.33,87 231.78,91.44 238.12,91.44 241.3,94.61 246.38,94.61 249.56,97.79 250.82,97.79 251.46,98.42 256.54,98.42 v257.18,99.06
  Route15 0.254: v203.2,93.34 201.93,94.61 200.66,94.61 182.88,112.39 182.25,112.39 179.71,114.94 177.16,112.39 175.9,112.39 173.35,114.94 170.18,114.94 A19.E2 | v257.18,99.06 259.08,99.06 269.88,88.27 269.88,83.19 272.42,80.64 272.42,80.01 305.44,46.99 305.44,45.72 307.98,43.18 307.98,41.27 309.25,40.01 B08.H2
DA11-1  (via drill 0.61)
  Route2 0.254: v201.29,9.53 207.01,9.53 215.9,18.41 221.62,18.41 238.12,34.92 239.4,34.92 241.94,37.47 244.47,37.47 245.75,38.73 B13.H2
  Route15 0.254: v201.29,9.53 200.66,10.16 199.39,8.89 197.49,8.89 189.23,17.14 184.15,12.06 175.26,12.06 170.81,16.51 167,16.51 B19.R2
DA_SEL_DEV0  (via drill 0.61)
  Top 0.254: v206.38,89.53 206.38,88.9 205.1,87.63 A16.R2 | 178.44,116.84 178.44,117.47 179.07,118.11 A18.D2 | 178.44,116.84 178.44,114.94 170.18,106.68 170.18,103.5 A19.K2 | 178.44,116.84 186.69,116.84 187.96,118.11 191.77,118.11 A17.D2 | v198.12,114.94 200.66,117.47 201.29,117.47 201.93,118.11 204.47,118.11 A16.D2 | A25.J2 90.81,106.68 90.81,110.49 95.25,114.94 95.25,116.2 91.44,120.02 90.81,119.38 A25.D2 | A19.D2 166.37,118.11 165.74,117.47 162.56,117.47 160.66,115.57 v160.66,114.94 160.02,114.94 155.57,110.49 | v147.32,85.09 149.22,85.09 149.86,85.72 153.03,85.72 153.67,86.36 | 153.67,86.36 154.94,85.09 161.29,85.09 161.93,85.72 165.1,85.72 165.74,86.36 166.37,86.36 A19.R2 | 153.67,86.36 A20.R2 | v155.57,106.05 155.57,110.49 | v121.92,78.74 123.19,78.74 147.96,103.5 148.59,103.5 155.57,110.49
  Route2 0.254: v180.97,90.17 179.71,88.9 179.71,87.63 A18.R2 | v178.44,96.52 182.25,100.33 182.25,102.23 A18.K2 | v198.12,114.94 192.41,109.22 194.94,106.68 194.94,103.5 A17.K2 | A19.K2 169.54,102.23 169.54,100.33 167.64,98.42 164.47,98.42 158.75,104.14 157.48,102.87 A20.K2
  Route15 0.254: v160.66,114.94 157.48,118.11 154.31,118.11 A20.D2
  Bottom 0.254: v180.97,90.17 180.97,89.53 181.61,88.9 186.69,88.9 | 186.69,88.9 187.32,88.9 187.96,88.27 191.13,88.27 191.77,87.63 A17.R2 | 186.69,88.9 179.07,96.52 v178.44,96.52 178.44,95.25 176.53,93.34 170.81,99.06 170.81,101.6 170.18,102.23 A19.K2 | v206.38,89.53 205.74,89.53 195.58,99.69 195.58,102.23 A17.K2 | A17.D2 192.41,118.11 193.68,116.84 196.22,116.84 v198.12,114.94 198.75,114.94 203.84,109.86 203.84,109.22 207.65,105.41 207.65,103.5 A16.K2 | v147.32,85.09 146.69,85.09 145.41,86.36 141.6,86.36 A21.R2 | A19.R2 166.37,87.63 165.74,88.27 162.56,88.27 153.67,97.16 156.84,100.33 156.84,102.23 A20.K2 156.84,103.5 155.57,104.78 v155.57,106.05 | v121.92,78.74 120.65,78.74 93.98,105.41 90.81,105.41 A25.J2
DA_SEL_DEV1  (via drill 0.61)
  Top 0.254: v154.94,14.61 154.31,13.97 154.31,11.43 B20.T2 | B19.T2 167,11.43 168.28,12.7 168.28,14.61 169.54,15.88 169.54,19.68 B19.P2 170.18,20.95 173.35,20.95 178.44,26.04 178.44,28.57 179.07,29.21 B18.L2 179.07,30.48 179.07,33.66 180.97,35.56 180.97,37.47 182.25,38.73 B18.H2 | B17.T2 192.41,11.43 192.41,15.24 193.68,16.51 193.68,17.78 195.58,19.68 B17.P2 | B18.T2 179.71,11.43 179.71,15.24 180.97,16.51 180.97,18.41 182.25,19.68 B18.P2 | B19.L2 167,30.48 167,34.29 168.28,35.56 168.28,37.47 169.54,38.73 B19.H2 170.18,40.01 173.35,40.01 178.44,45.09 178.44,47.62 179.07,48.26 B18.D2 | v188.59,34.92 192.41,38.73 194.94,38.73 B17.H2
  Route2 0.254: B17.D2 191.77,48.26 188.59,48.26 183.51,43.18 183.51,40.64 182.88,40.01 B18.H2
  Route15 0.254: A25.L2 90.81,100.33 90.81,103.5 93.98,106.68 92.08,108.58 92.08,110.49 90.81,111.76 A25.F2 | v155.57,62.23 155.57,57.15 162.56,50.16 165.74,50.16 166.37,49.53 B19.D2
  Bottom 0.254: v154.94,14.61 157.48,17.14 162.56,12.06 165.74,12.06 166.37,11.43 B19.T2 | B18.L2 179.71,29.21 179.71,25.4 180.97,24.13 180.97,22.23 182.25,20.95 B18.P2 182.88,19.68 183.51,19.05 186.69,19.05 191.77,13.97 191.77,11.43 B17.T2 | 177.8,41.27 176.53,42.55 | 176.53,42.55 170.81,48.26 167,48.26 B19.D2 | 177.8,41.27 180.97,41.27 182.25,40.01 B18.H2 | 176.53,42.55 179.07,45.09 179.07,48.26 B18.D2 | 177.8,41.27 186.06,33.02 | 186.06,33.02 188.59,30.48 191.77,30.48 B17.L2 | v188.59,34.92 187.96,34.92 186.06,33.02 | v155.57,62.23 140.34,77.47 140.34,78.74 111.12,107.95 105.41,107.95 102.87,110.49 101.6,110.49 96.52,115.57 93.98,113.03 90.81,113.03 A25.F2
DAEX1  (via drill 0.61)
  Top 0.254: v171.45,90.17 171.45,92.08 170.18,93.34 187.96,111.12 189.23,111.12 v190.5,112.39 | v217.81,110.49 225.43,110.49 226.06,111.12 231.78,111.12 250.82,130.18 v252.73,130.18
  Route2 0.254: v99.06,36.83 99.69,36.2 117.47,53.98 117.47,59.05 123.83,65.41 123.83,66.67 149.22,92.08 158.75,92.08 166.37,84.45 171.45,89.53 v171.45,90.17 | v190.5,112.39 190.5,111.12 191.77,109.86 v198.75,116.84
  Route15 0.254: v99.06,36.83 93.98,41.91 90.81,41.91 B25.F2 | v198.75,116.84 199.39,116.84 200.66,118.11 201.29,117.47 206.38,117.47 207.01,116.84 210.19,116.84 215.9,111.12 217.17,111.12 v217.81,110.49
  Bottom 0.254: v252.73,130.18 253.37,130.18 263.52,120.02 267.33,120.02 267.97,119.38 A11.D2
DAEX1-0  (via drill 0.61)
  Top 0.254: v236.22,78.74 236.22,78.11 231.14,73.03 225.43,73.03 224.79,72.39 222.25,72.39 220.34,70.48 216.53,70.48 v215.26,69.22
  Route2 0.254: v215.26,69.22 214,69.22 207.65,62.87 207.65,61.59 199.39,53.34 191.13,53.34 189.87,54.61 v190.5,55.24
  Route15 0.254: v190.5,55.24 188.59,55.24 184.15,59.69 178.44,59.69 176.53,61.59 170.18,61.59 155.57,76.2 153.67,76.2 v153.03,76.83
  Bottom 0.254: v236.22,78.74 236.22,78.11 264.8,49.53 267.97,49.53 B11.D2 | v153.03,76.83 153.03,78.11 148.59,82.55 145.41,82.55 144.78,83.19 A21.S2
DAEX1-1  (via drill 0.61)
  Top 0.254: v177.8,31.11 170.81,24.13 170.81,23.5 163.83,16.51 163.19,16.51 157.48,10.79 157.48,8.26 B20.U2
  Route2 0.254: v177.8,31.11 184.15,31.11 184.78,31.75 186.69,31.75 189.23,29.21 191.13,31.11 192.41,31.11 193.68,32.38 193.68,34.92 196.85,38.1 196.85,41.27 195.58,42.55 200.66,47.62 203.84,47.62 204.47,48.26 B16.D2